# Altium schematic sheet POWER_SUPPLY.SchDoc
size A4; SheetNumber: 4; SheetTotal: 5
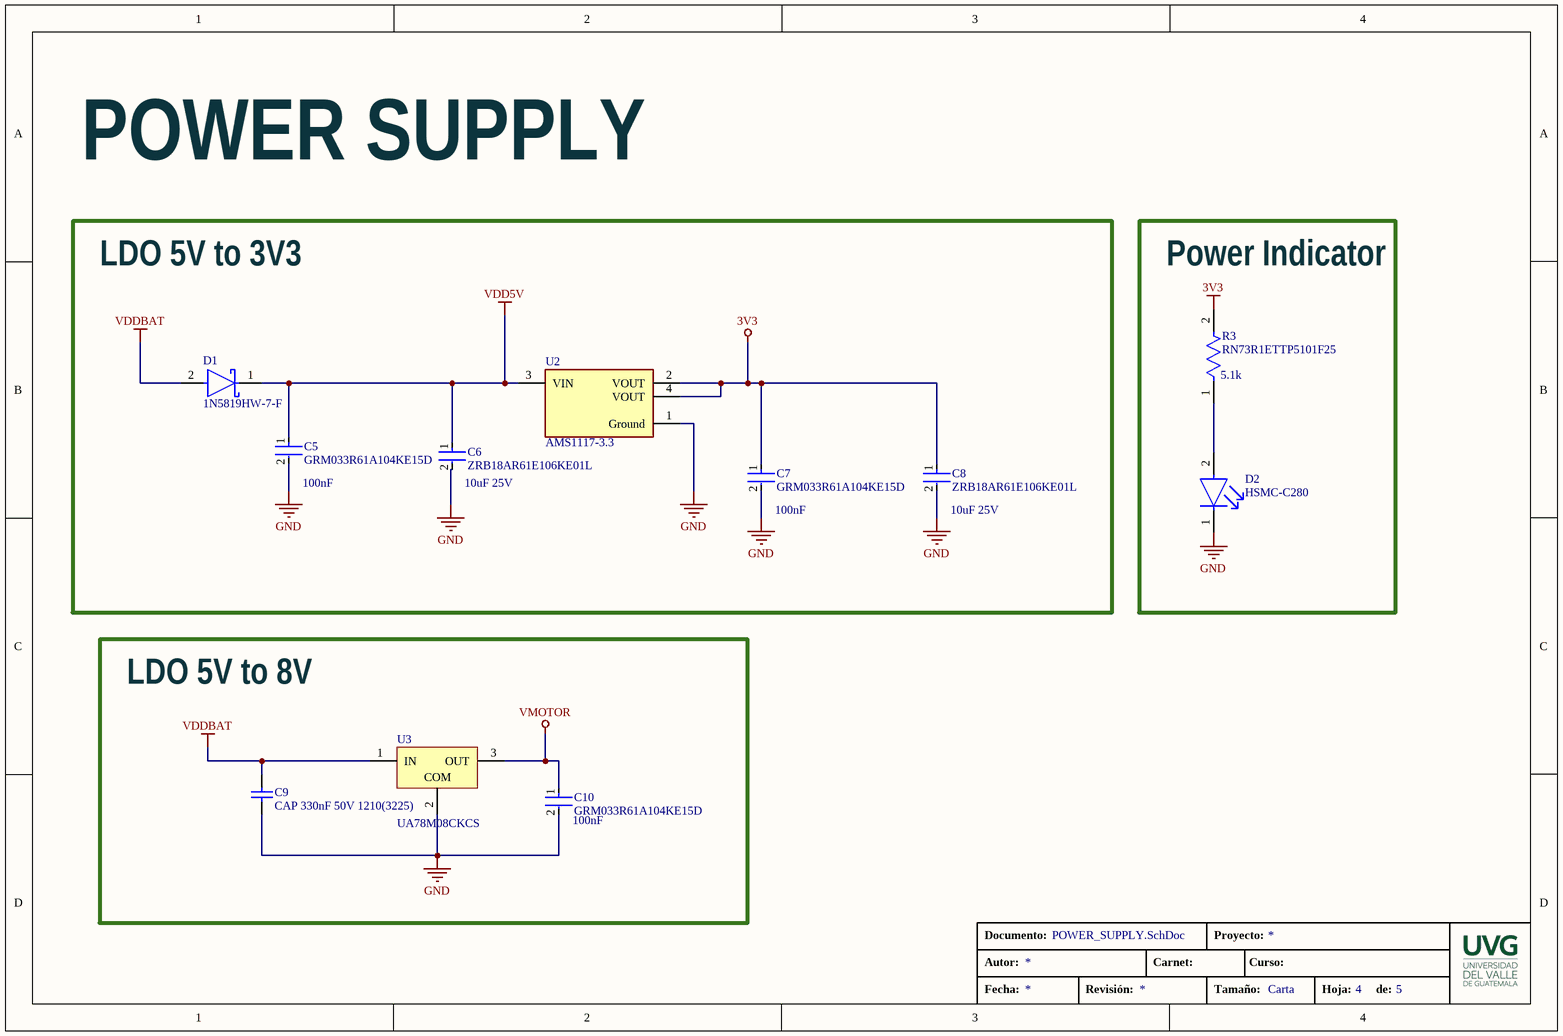
[diagram p0: POWER_SUPPLY.SchDoc]

## Parts
C5  GRM033R61A104KE15D  Capacitance: 100nF  [FP-GRM033-0_03-IPC_C]
C6  ZRB18AR61E106KE01L  value 10uF 25V  [FP-ZRB18A-0_2-MFG]
C7  GRM033R61A104KE15D  Capacitance: 100nF  [FP-GRM033-0_03-IPC_C]
C8  ZRB18AR61E106KE01L  value 10uF 25V  [FP-ZRB18A-0_2-MFG]
C9  CAP 330nF 50V 1210(3225)  [CAPC1210(3225)105_L]
C10  GRM033R61A104KE15D  Capacitance: 100nF  [FP-GRM033-0_03-IPC_C]
D1  1N5819HW-7-F  [FP-SOD123-IPC_A]
D2  HSMC-C280  [FP-HSMC-C280-MFG]
R3  RN73R1ETTP5101F25  value 5.1k  [FP-RN73R1E-IPC_C]
U2  AMS1117-3.3  [FP-AMS1117-IPC_C]
U3  UA78M08CKCS  [KCS0003A]

## Blocks framed on the sheet
LDO 5V to 3V3: C5-C8 D1 U2
Power Indicator: D2 R3
LDO 5V to 8V: C9 C10 U3

## Nets
3V3: C7.1 C8.1 R3.2 U2.2(VOUT) U2.4(VOUT)
GND: C5.2 C6.2 C7.2 C8.2 C9.1 C10.2 D2.1(C) U2.1(Ground) U3.2(COM)
VDD5V: C5.1 C6.1 D1.1(C) U2.3(VIN)
VDDBAT: C9.2 D1.2(A) U3.1(IN)
VMOTOR: C10.1 U3.3(OUT)
NetD2_2: D2.2(A) R3.1

## Notes on the sheet
- POWER SUPPLY
- Documento:
- Autor:
- Carnet:
- Proyecto:
- Curso:
- Fecha:
- Revisión:
- Tamaño:
- Carta
- Hoja:
- de:

## Library data of the parts
C5 C7 C10 = CMP-2010-01264-2: Chip Multilayer Ceramic Capacitors for General Purpose, 0201, 0.10uF, X5R, 15%, 10%, 10V; Mount: Surface Mount; Dielectric: X5R; Width: 0.012inch; Tolerance: 10%; Radiation Hardening: No; Voltage Rating: 10V; REACH SVHC: No SVHC; Height: 0.3mm; Max Operating Temperature: 85°C; Voltage Rating (DC): 10V; Thickness: 0.013inch; Termination: SMD/SMT; Lead Free: Lead Free; Package Quantity: 1; Case/Package: 0201; Min Operating Temperature: -55°C; Weight: 6E-06oz; Length: 0.6mm; Case Code (Imperial): 0201; Depth: 0.3mm; Voltage: 10V; Packaging: Tape and Reel; Case Code (Metric): 0603
C6 C8 = CMP-06035-063177-1: Low Acoustic Noise Chip Multilayer Ceramic Capacitors on Interposer Board for General Purpose ZRB Series 0603 Package 1.2mm X5R @ 15% 25Vdc 10uF @ 10%
C9 = CMP-1038-01880-1: CAP 330nF 50V ±10% 1210 (3225 Metric) Thickness 1.05mm SMD; Tolerance: Â±10%; Case-Metric: 3225; Case-EIA: 1210; Technology: SMT; Rated Voltage: 50 V; Value: 330nF; Max Thickness: 1.05 mm
D1 = CMP-0303-00003-3: DIODE SCHOTTKY 40V 1A SOD123; Forward Voltage: 450mV; Capacitance: 110pF; Max Forward Surge Current (Ifsm): 25A; Peak Reverse Current: 50uA; Polarity: Standard; Element Configuration: Single; Max Power Dissipation: 450mW; Min Operating Temperature: -65°C; Package Quantity: 3000; Contact Plating: Tin; Weight: 0.000353oz; Max Repetitive Reverse Voltage (Vrrm): 40V; Max Reverse Voltage (DC): 40V; Height: 1.25mm; Average Rectified Current: 1A; Width: 1.7mm; Case/Package: SOD-123-2; Lead Free: Lead Free; Max Operating Temperature: 125°C; Current Rating: 1A; Termination: SMD/SMT; Forward Current: 1A; Radiation Hardening: No; Number of Pins: 2; Length: 2.85mm; Voltage Rating (DC): 40V; REACH SVHC: No SVHC; Peak Non-Repetitive Surge Current: 25A; Packaging: Tape and Reel; Output Current: 1A
D2 = CMP-18399-000022-1: LED RED DIFFUSED 0402 SMD; Dominant Wavelength: 626nm; Number of Elements: 1; Luminous Intensity: 90mcd; Viewing Angle: 130°; Reverse Voltage: 5V; Forward Current: 20mA; Lens Color: White; Power Rating: 60mW; Forward Voltage: 1.9V; Luminous Flux: 155lm; Contact Plating: Gold; Number of Pins: 2; REACH SVHC: No SVHC; Lens Style: Diffused; Color: Red; Packaging: Tape and Reel; Max Operating Temperature: 85°C; Radiation Hardening: No; Length: 1mm; Number of LEDs: 1; Case/Package: 0402; Min Operating Temperature: -40°C; Case Code (Metric): 1005; Case Code (Imperial): 0402; Test Current: 20mA; Lead Free: Lead Free; Height: 0.4mm; Illumination Color: Red; Max Power Dissipation: 60mW; Package Quantity: 4000; Mount: Surface Mount; Wavelength: 626nm; Depth: 0.5mm; Lens Transparency: Diffused; Power Dissipation: 60mW; Width: 0.5mm
R3 = CMP-04015-008529-1: 5.1kΩ ±1% 0.063W, 1/16W Chip Resistor 0402 (1005 Metric) Moisture Resistant Thin Film
U2 = CMP-209535-000001-1: LDO Voltage Regulators 1A, 3.3V; Manufacturer: Advanced Monolithic Systems; Dropout Voltage: 1.1V; Output Type: Fixed; Nominal Supply Current: 5mA; Max Power Dissipation: 1.2W; Max Supply Voltage: 15V; Number Of Outputs: 1; Standoff Height: 0.64mm; Max Junction Temp: +125°C; Height: 1.8mm; Package: AMS1117; Device Class L2: Power Management ICs; ComponentLink2Description: Datasheet; ComponentLink2URL: http://www.advanced-monolithic.com/pdf/ds1117.pdf; Category: IC; RoHS: TRUE; Automotive: No; Device Class L1: Integrated Circuits (ICs); Output Current: 1A; Device Class L3: Voltage Regulators - Linear; Temperature: -40°C to +125°C; Output Voltage: 3.3V; Manufacturer Part Number: AMS1117-3.3; Temperature Range Low: -40°C; Octopart: https://octopart.com/ams1117-3.3-advanced+monolithic+systems-25899300; Lead Free: Yes; Ipc Land Pattern Name: SOT229P700X180-4; Temperature Range High: +125°C
U3 = CMP-0324-00074-2: Fixed Regulator with 10.5 to 25 V Input and 8 V Output, 0 to 125 degC, 3-Pin TO-220 (KCS), Pb-Free (RoHS); Manufacturer: Texas Instruments; Vin(Max)(V): 25; Vout(Min)(V): 8; Iout(Max)(A): 0.5; Vin(Min)(V): 10.5; Iq(Typ)(mA): 6; SubFamily: Standard Voltage Regulator; PackageReference: KCS0003A; ComponentLink2Description: URL Link1; ComponentLink1Description: Datasheet; Eco-Plan: Pb-Free (RoHS); PackageDescription: Plastic Cylindrical Package, Formed Lead Option (TO-92); PackageVersion: revC, Oct-2001; Mounting Technology: Through Hole; Code_JEDEC: TO-226-AA; DatasheetVersion: SLVS059Q; ComponentLink2URL: Samples URL:http://www.ti.com/product/ua78m08#samples; Vout(Max)(V): 8; PartNumber: UA78M08CKCS; ComponentLink1URL: http://www.ti.com/general/docs/lit/getliterature.tsp?genericPartNumber=UA78M08&fileType=pdf